# EAGLE schematic board (EAGLE 9.5.2)
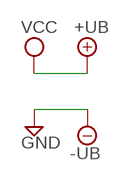
[diagram p0: schematic, sheet 1, part 1 of 3]
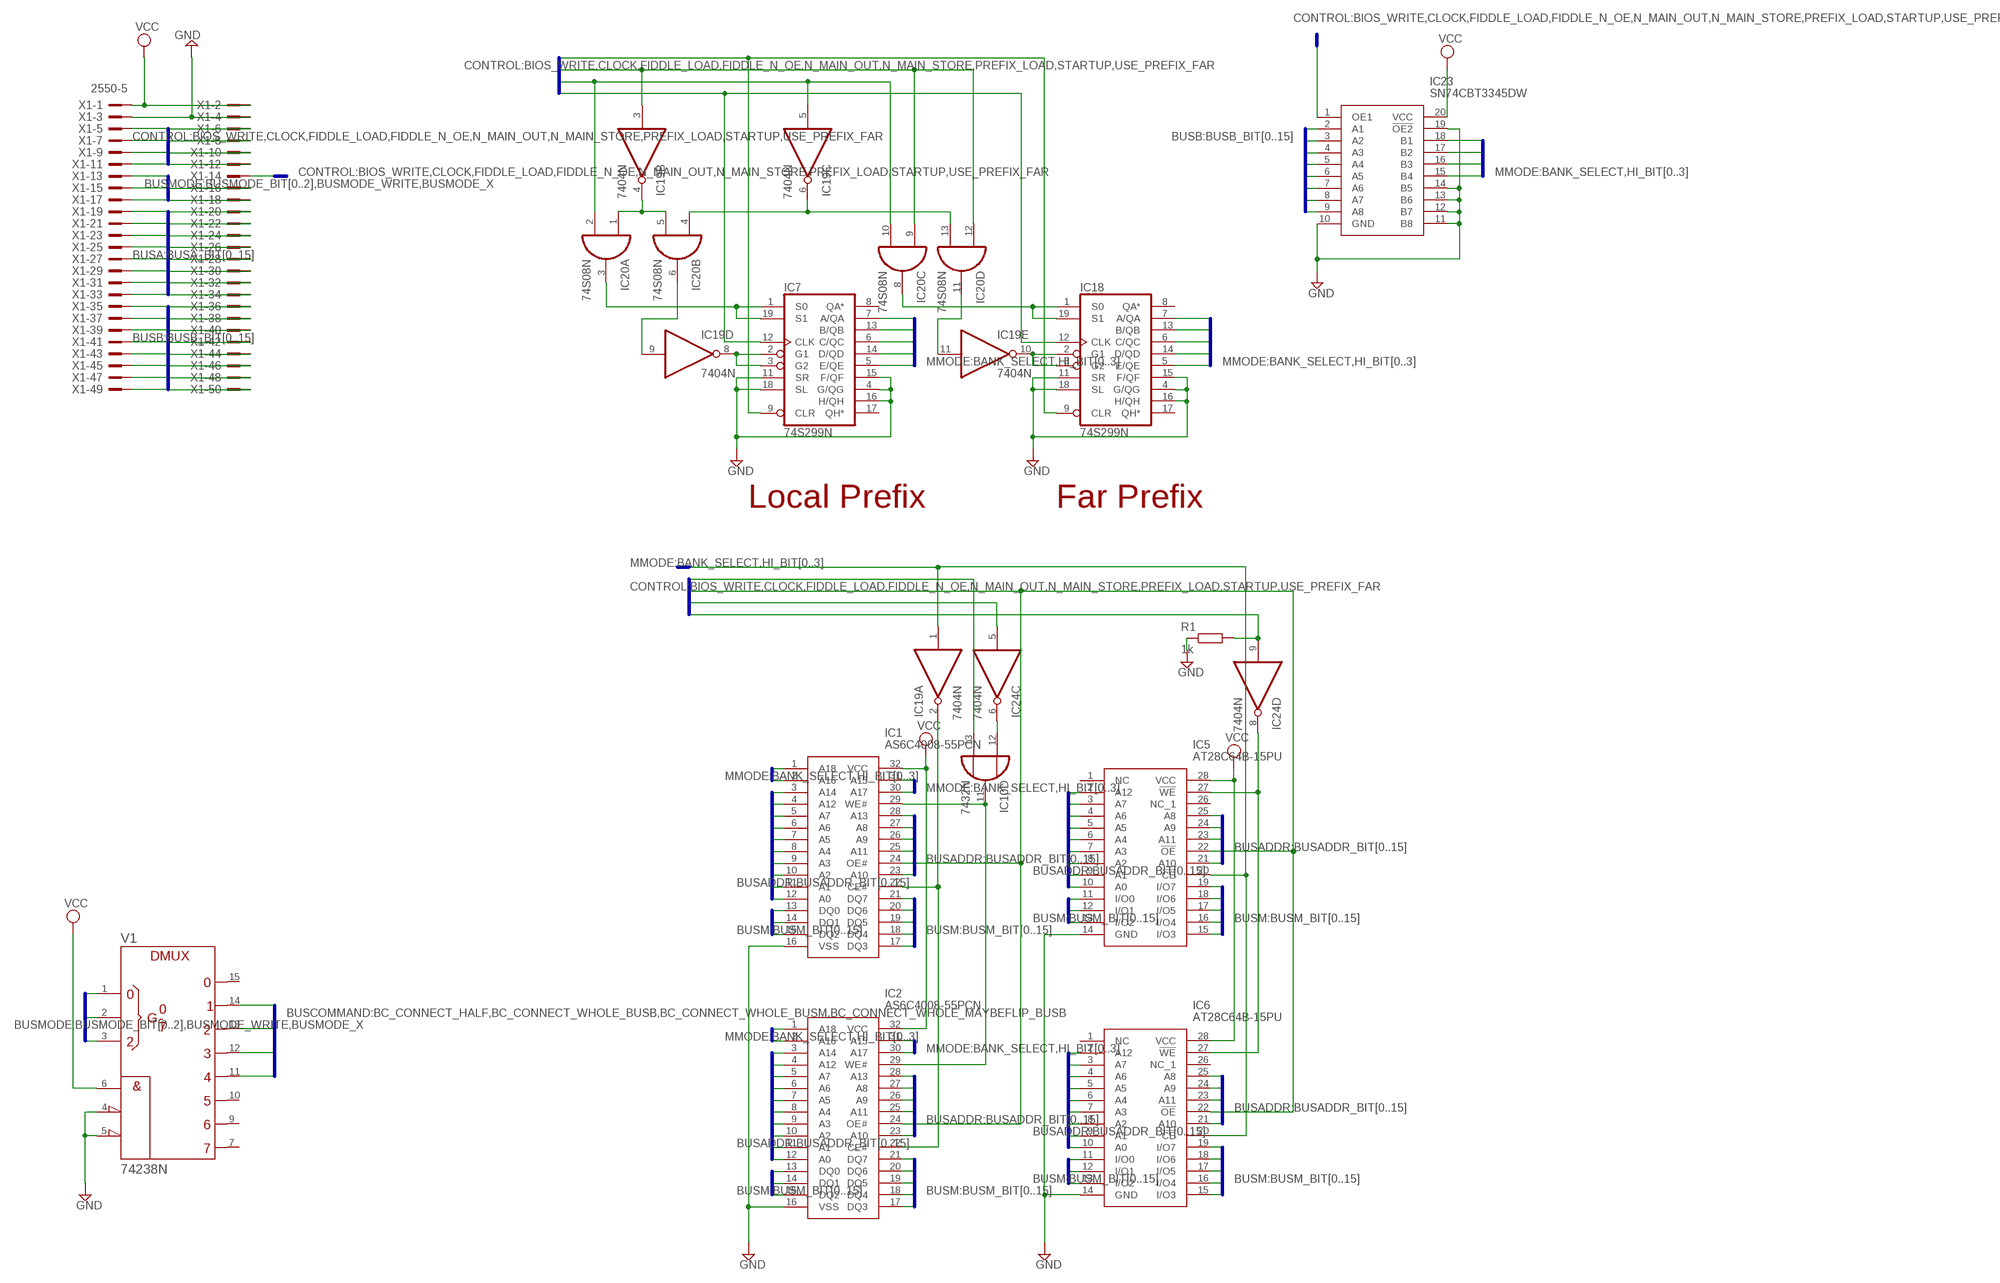
[diagram p1: schematic, sheet 1, part 2 of 3]
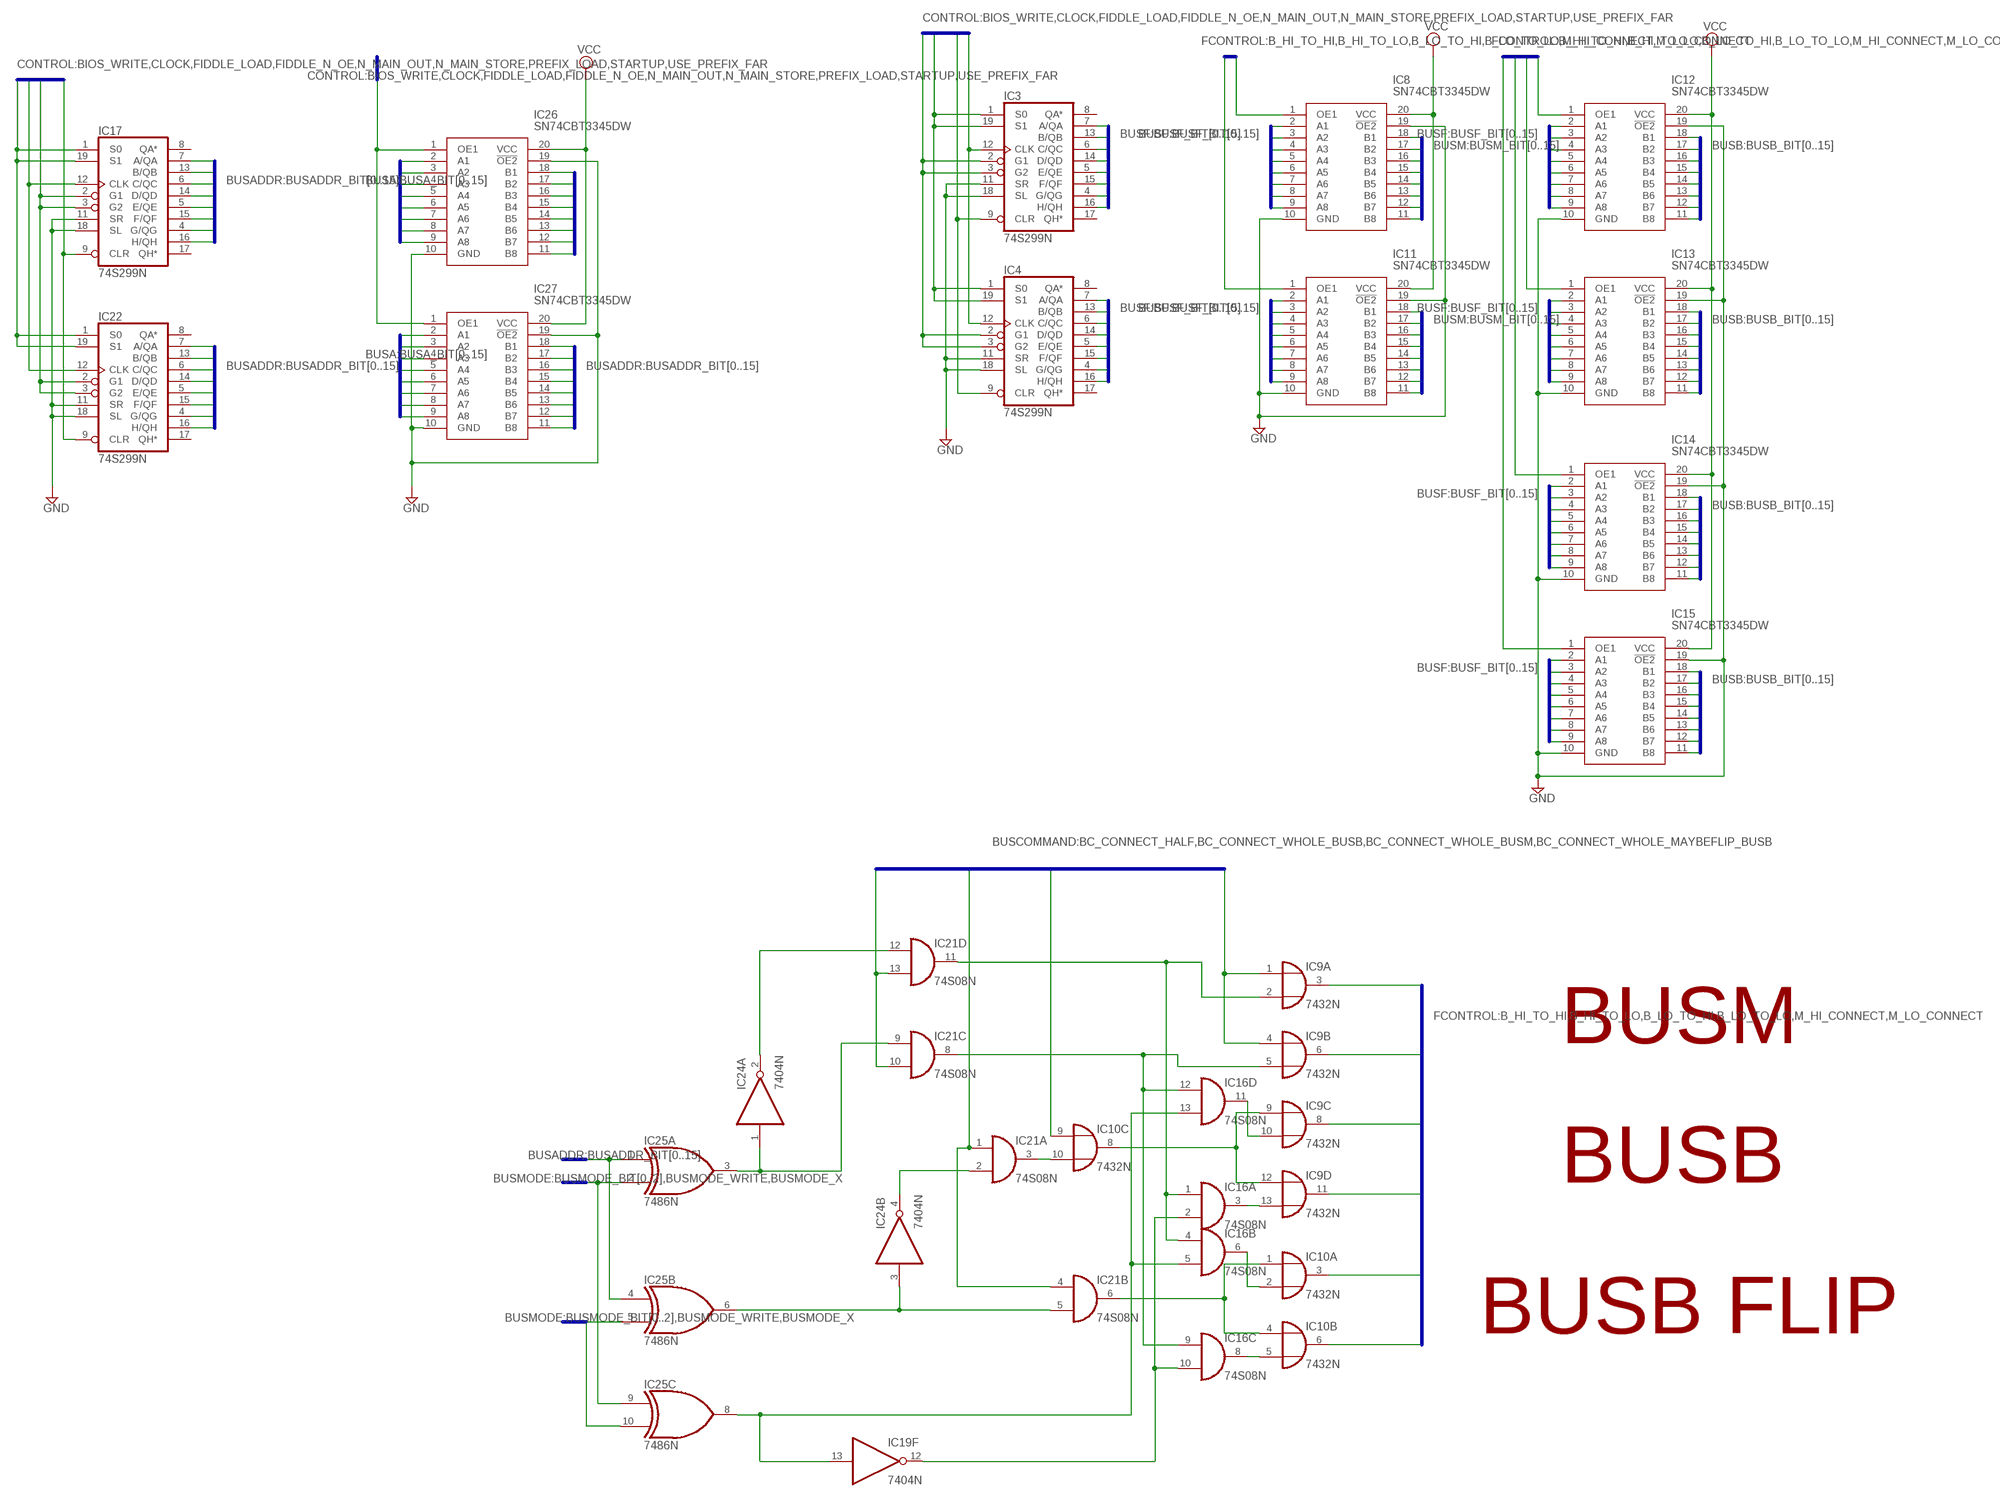
[diagram p2: schematic, sheet 1, part 3 of 3]

## Parts
IC1  AS6C4008-55PCN  [DIP1524W58P254L4191H406Q32N]
IC2  AS6C4008-55PCN  [DIP1524W58P254L4191H406Q32N]
IC3  74S299N  [DIL20]
IC4  74S299N  [DIL20]
IC5  AT28C64B-15PU  [DIP1556W56P254L3702H483Q28N]
IC6  AT28C64B-15PU  [DIP1556W56P254L3702H483Q28N]
IC7  74S299N  [DIL20]
IC8  SN74CBT3345DW  [SOIC127P1030X265-20N]
IC9  7432N  [DIL14]
IC10  7432N  [DIL14]
IC11  SN74CBT3345DW  [SOIC127P1030X265-20N]
IC12  SN74CBT3345DW  [SOIC127P1030X265-20N]
IC13  SN74CBT3345DW  [SOIC127P1030X265-20N]
IC14  SN74CBT3345DW  [SOIC127P1030X265-20N]
IC15  SN74CBT3345DW  [SOIC127P1030X265-20N]
IC16  74S08N  [DIL14]
IC17  74S299N  [DIL20]
IC18  74S299N  [DIL20]
IC19  7404N  [DIL14]
IC20  74S08N  [DIL14]
IC21  74S08N  [DIL14]
IC22  74S299N  [DIL20]
IC23  SN74CBT3345DW  [SOIC127P1030X265-20N]
IC24  7404N  [DIL14]
IC25  7486N  [DIL14]
IC26  SN74CBT3345DW  [SOIC127P1030X265-20N]
IC27  SN74CBT3345DW  [SOIC127P1030X265-20N]
R1  1k  R-EU_0207/10  [0207/10]
V1  74238N  [DIL16]
X1  2550-5  [PAK100/2500-5-50]

## Nets
B_HI_TO_HI: IC9.11(D:O) IC15.1(OE1)
B_HI_TO_LO: IC10.6(B:O) IC14.1(OE1)
B_LO_TO_HI: IC10.3(A:O) IC13.1(OE1)
B_LO_TO_LO: IC9.8(C:O) IC12.1(OE1)
BANK_SELECT: IC5.20(!CE) IC6.20(!CE) IC7.7(A/QA) IC18.7(A/QA) IC19.1(A:I)
BC_CONNECT_HALF: IC21.10(C:I1) IC21.13(D:I1) V1.14(Y1)
BC_CONNECT_WHOLE_BUSB: IC10.9(C:I0) V1.12(Y3)
BC_CONNECT_WHOLE_BUSM: IC9.1(A:I0) IC9.4(B:I0) V1.13(Y2)
BC_CONNECT_WHOLE_MAYBEFLIP_BUSB: IC21.1(A:I0) IC21.4(B:I0) V1.11(Y4)
BIOS_WRITE: IC24.9(D:I) R1.2 X1.14
BUSA_BIT0: IC26.2(A1) X1.19
BUSA_BIT1: IC26.3(A2) X1.20
BUSA_BIT2: IC26.4(A3) X1.21
BUSA_BIT3: IC26.5(A4) X1.22
BUSA_BIT4: IC26.6(A5) X1.23
BUSA_BIT5: IC26.7(A6) X1.24
BUSA_BIT6: IC26.8(A7) X1.25
BUSA_BIT7: IC26.9(A8) X1.26
BUSA_BIT8: IC27.2(A1) X1.27
BUSA_BIT9: IC27.3(A2) X1.28
BUSA_BIT10: IC27.4(A3) X1.29
BUSA_BIT11: IC27.5(A4) X1.30
BUSA_BIT12: IC27.6(A5) X1.31
BUSA_BIT13: IC27.7(A6) X1.32
BUSA_BIT14: IC27.8(A7) X1.33
BUSA_BIT15: IC27.9(A8) X1.34
BUSADDR_BIT0: IC17.7(A/QA) IC25.1(A:I0) IC25.4(B:I0) IC26.18(B1)
BUSADDR_BIT1: IC1.12(A0) IC2.12(A0) IC5.10(A0) IC6.10(A0) IC17.13(B/QB) IC26.17(B2)
BUSADDR_BIT2: IC1.11(A1) IC2.11(A1) IC5.9(A1) IC6.9(A1) IC17.6(C/QC) IC26.16(B3)
BUSADDR_BIT3: IC1.10(A2) IC2.10(A2) IC5.8(A2) IC6.8(A2) IC17.14(D/QD) IC26.15(B4)
BUSADDR_BIT4: IC1.9(A3) IC2.9(A3) IC5.7(A3) IC6.7(A3) IC17.5(E/QE) IC26.14(B5)
BUSADDR_BIT5: IC1.8(A4) IC2.8(A4) IC5.6(A4) IC6.6(A4) IC17.15(F/QF) IC26.13(B6)
BUSADDR_BIT6: IC1.7(A5) IC2.7(A5) IC5.5(A5) IC6.5(A5) IC17.4(G/QG) IC26.12(B7)
BUSADDR_BIT7: IC1.6(A6) IC2.6(A6) IC5.4(A6) IC6.4(A6) IC17.16(H/QH) IC26.11(B8)
BUSADDR_BIT8: IC1.5(A7) IC2.5(A7) IC5.3(A7) IC6.3(A7) IC22.7(A/QA) IC27.18(B1)
BUSADDR_BIT9: IC1.27(A8) IC2.27(A8) IC5.25(A8) IC6.25(A8) IC22.13(B/QB) IC27.17(B2)
BUSADDR_BIT10: IC1.26(A9) IC2.26(A9) IC5.24(A9) IC6.24(A9) IC22.6(C/QC) IC27.16(B3)
BUSADDR_BIT11: IC1.23(A10) IC2.23(A10) IC5.21(A10) IC6.21(A10) IC22.14(D/QD) IC27.15(B4)
BUSADDR_BIT12: IC1.25(A11) IC2.25(A11) IC5.23(A11) IC6.23(A11) IC22.5(E/QE) IC27.14(B5)
BUSADDR_BIT13: IC1.4(A12) IC2.4(A12) IC5.2(A12) IC6.2(A12) IC22.15(F/QF) IC27.13(B6)
BUSADDR_BIT14: IC1.28(A13) IC2.28(A13) IC22.4(G/QG) IC27.12(B7)
BUSADDR_BIT15: IC1.3(A14) IC2.3(A14) IC22.16(H/QH) IC27.11(B8)
BUSB_BIT0: IC12.18(B1) IC13.18(B1) IC23.2(A1) X1.35
BUSB_BIT1: IC12.17(B2) IC13.17(B2) IC23.3(A2) X1.36
BUSB_BIT2: IC12.16(B3) IC13.16(B3) IC23.4(A3) X1.37
BUSB_BIT3: IC12.15(B4) IC13.15(B4) IC23.5(A4) X1.38
BUSB_BIT4: IC12.14(B5) IC13.14(B5) IC23.6(A5) X1.39
BUSB_BIT5: IC12.13(B6) IC13.13(B6) IC23.7(A6) X1.40
BUSB_BIT6: IC12.12(B7) IC13.12(B7) IC23.8(A7) X1.41
BUSB_BIT7: IC12.11(B8) IC13.11(B8) IC23.9(A8) X1.42
BUSB_BIT8: IC14.18(B1) IC15.18(B1) X1.43
BUSB_BIT9: IC14.17(B2) IC15.17(B2) X1.44
BUSB_BIT10: IC14.16(B3) IC15.16(B3) X1.45
BUSB_BIT11: IC14.15(B4) IC15.15(B4) X1.46
BUSB_BIT12: IC14.14(B5) IC15.14(B5) X1.47
BUSB_BIT13: IC14.13(B6) IC15.13(B6) X1.48
BUSB_BIT14: IC14.12(B7) IC15.12(B7) X1.49
BUSB_BIT15: IC14.11(B8) IC15.11(B8) X1.50
BUSF_BIT0: IC3.7(A/QA) IC8.2(A1) IC12.2(A1) IC14.2(A1)
BUSF_BIT1: IC3.13(B/QB) IC8.3(A2) IC12.3(A2) IC14.3(A2)
BUSF_BIT2: IC3.6(C/QC) IC8.4(A3) IC12.4(A3) IC14.4(A3)
BUSF_BIT3: IC3.14(D/QD) IC8.5(A4) IC12.5(A4) IC14.5(A4)
BUSF_BIT4: IC3.5(E/QE) IC8.6(A5) IC12.6(A5) IC14.6(A5)
BUSF_BIT5: IC3.15(F/QF) IC8.7(A6) IC12.7(A6) IC14.7(A6)
BUSF_BIT6: IC3.4(G/QG) IC8.8(A7) IC12.8(A7) IC14.8(A7)
BUSF_BIT7: IC3.16(H/QH) IC8.9(A8) IC12.9(A8) IC14.9(A8)
BUSF_BIT8: IC4.7(A/QA) IC11.2(A1) IC13.2(A1) IC15.2(A1)
BUSF_BIT9: IC4.13(B/QB) IC11.3(A2) IC13.3(A2) IC15.3(A2)
BUSF_BIT10: IC4.6(C/QC) IC11.4(A3) IC13.4(A3) IC15.4(A3)
BUSF_BIT11: IC4.14(D/QD) IC11.5(A4) IC13.5(A4) IC15.5(A4)
BUSF_BIT12: IC4.5(E/QE) IC11.6(A5) IC13.6(A5) IC15.6(A5)
BUSF_BIT13: IC4.15(F/QF) IC11.7(A6) IC13.7(A6) IC15.7(A6)
BUSF_BIT14: IC4.4(G/QG) IC11.8(A7) IC13.8(A7) IC15.8(A7)
BUSF_BIT15: IC4.16(H/QH) IC11.9(A8) IC13.9(A8) IC15.9(A8)
BUSM_BIT0: IC1.13(DQ0) IC5.11(I/O0) IC6.11(I/O0) IC8.18(B1)
BUSM_BIT1: IC1.14(DQ1) IC5.12(I/O1) IC6.12(I/O1) IC8.17(B2)
BUSM_BIT2: IC1.15(DQ2) IC5.13(I/O2) IC6.13(I/O2) IC8.16(B3)
BUSM_BIT3: IC1.17(DQ3) IC5.15(I/O3) IC6.15(I/O3) IC8.15(B4)
BUSM_BIT4: IC1.18(DQ4) IC5.16(I/O4) IC6.16(I/O4) IC8.14(B5)
BUSM_BIT5: IC1.19(DQ5) IC5.17(I/O5) IC6.17(I/O5) IC8.13(B6)
BUSM_BIT6: IC1.20(DQ6) IC5.18(I/O6) IC6.18(I/O6) IC8.12(B7)
BUSM_BIT7: IC1.21(DQ7) IC5.19(I/O7) IC6.19(I/O7) IC8.11(B8)
BUSM_BIT8: IC2.13(DQ0) IC11.18(B1)
BUSM_BIT9: IC2.14(DQ1) IC11.17(B2)
BUSM_BIT10: IC2.15(DQ2) IC11.16(B3)
BUSM_BIT11: IC2.17(DQ3) IC11.15(B4)
BUSM_BIT12: IC2.18(DQ4) IC11.14(B5)
BUSM_BIT13: IC2.19(DQ5) IC11.13(B6)
BUSM_BIT14: IC2.20(DQ6) IC11.12(B7)
BUSM_BIT15: IC2.21(DQ7) IC11.11(B8)
BUSMODE_BIT0: V1.1(A) X1.13
BUSMODE_BIT1: V1.2(B) X1.15
BUSMODE_BIT2: V1.3(C) X1.17
BUSMODE_WRITE: IC25.2(A:I1) IC25.9(C:I0) X1.16
BUSMODE_X: IC25.5(B:I1) IC25.10(C:I1) X1.18
CLOCK: IC3.12(CLK) IC4.12(CLK) IC7.12(CLK) IC17.12(CLK) IC18.12(CLK) IC22.12(CLK) IC24.5(C:I) X1.5
FIDDLE_LOAD: IC3.1(S0) IC3.19(S1) IC4.1(S0) IC4.19(S1) IC17.1(S0) IC17.19(S1) IC22.1(S0) IC22.19(S1) IC26.1(OE1) IC27.1(OE1) X1.11
FIDDLE_N_OE: IC3.2(G1) IC3.3(G2) IC4.2(G1) IC4.3(G2) IC17.2(G1) IC17.3(G2) IC22.2(G1) IC22.3(G2) X1.12
GND: IC1.16(VSS) IC2.16(VSS) IC3.11(SR) IC3.18(SL) IC4.11(SR) IC4.18(SL) IC5.14(GND) IC6.14(GND) IC7.4(G/QG) IC7.11(SR) IC7.15(F/QF) IC7.16(H/QH) IC7.18(SL) IC8.10(GND) IC8.19(!OE2) IC11.10(GND) IC11.19(!OE2) IC12.10(GND) IC12.19(!OE2) IC13.10(GND) IC13.19(!OE2) IC14.10(GND) IC14.19(!OE2) IC15.10(GND) IC15.19(!OE2) IC17.11(SR) IC17.18(SL) IC18.4(G/QG) IC18.11(SR) IC18.15(F/QF) IC18.16(H/QH) IC18.18(SL) IC22.11(SR) IC22.18(SL) IC23.10(GND) IC23.11(B8) IC23.12(B7) IC23.13(B6) IC23.14(B5) IC23.19(!OE2) IC26.10(GND) IC26.19(!OE2) IC27.10(GND) IC27.19(!OE2) R1.1 V1.4(!G2A) V1.5(!G2B) X1.3 X1.4 ; supply symbol labelled -UB
HI_BIT0: IC1.31(A15) IC2.31(A15) IC7.13(B/QB) IC18.13(B/QB) IC23.18(B1)
HI_BIT1: IC1.2(A16) IC2.2(A16) IC7.6(C/QC) IC18.6(C/QC) IC23.17(B2)
HI_BIT2: IC1.30(A17) IC2.30(A17) IC7.14(D/QD) IC18.14(D/QD) IC23.16(B3)
HI_BIT3: IC1.1(A18) IC2.1(A18) IC7.5(E/QE) IC18.5(E/QE) IC23.15(B4)
M_HI_CONNECT: IC9.6(B:O) IC11.1(OE1)
M_LO_CONNECT: IC8.1(OE1) IC9.3(A:O)
N$1: IC19.4(B:O) IC20.1(A:I0) IC20.5(B:I1)
N$2: IC7.1(S0) IC7.19(S1) IC20.3(A:O)
N$3: IC18.1(S0) IC18.19(S1) IC20.8(C:O)
N$4: IC18.2(G1) IC18.3(G2) IC19.10(E:O)
N$5: IC7.2(G1) IC7.3(G2) IC19.8(D:O)
N$6: IC1.22(CE#) IC2.22(CE#) IC19.2(A:O)
N$7: IC19.11(E:I) IC20.11(D:O)
N$8: IC19.9(D:I) IC20.6(B:O)
N$9: IC19.6(C:O) IC20.4(B:I0) IC20.13(D:I1)
N$10: IC10.1(A:I0) IC10.4(B:I0) IC21.6(B:O)
N$11: IC10.10(C:I1) IC21.3(A:O)
N$12: IC21.2(A:I1) IC24.4(B:O)
N$13: IC9.10(C:I1) IC16.11(D:O)
N$14: IC21.5(B:I1) IC24.3(B:I) IC25.6(B:O)
N$15: IC9.5(B:I1) IC16.9(C:I0) IC16.12(D:I0) IC21.8(C:O)
N$16: IC21.12(D:I0) IC24.2(A:O)
N$17: IC21.9(C:I0) IC24.1(A:I) IC25.3(A:O)
N$18: IC9.9(C:I0) IC9.12(D:I0) IC10.8(C:O)
N$19: IC9.13(D:I1) IC16.3(A:O)
N$20: IC10.2(A:I1) IC16.6(B:O)
N$21: IC10.5(B:I1) IC16.8(C:O)
N$22: IC9.2(A:I1) IC16.1(A:I0) IC16.4(B:I0) IC21.11(D:O)
N$23: IC16.2(A:I1) IC16.10(C:I1) IC19.12(F:O)
N$24: IC16.5(B:I1) IC16.13(D:I1) IC19.13(F:I) IC25.8(C:O)
N$25: IC1.29(WE#) IC2.29(WE#) IC10.11(D:O)
N$26: IC10.12(D:I0) IC24.6(C:O)
N$27: IC5.27(!WE) IC6.27(!WE) IC24.8(D:O)
N_MAIN_OUT: IC1.24(OE#) IC2.24(OE#) IC5.22(!OE) IC6.22(!OE) X1.9
N_MAIN_STORE: IC10.13(D:I1) X1.10
PREFIX_LOAD: IC19.5(C:I) IC20.2(A:I1) IC20.10(C:I1) IC23.1(OE1) X1.8
STARTUP: IC3.9(CLR) IC4.9(CLR) IC7.9(CLR) IC17.9(CLR) IC18.9(CLR) IC22.9(CLR) X1.6
USE_PREFIX_FAR: IC19.3(B:I) IC20.9(C:I0) IC20.12(D:I0) X1.7
VCC: IC1.32(VCC) IC2.32(VCC) IC5.28(VCC) IC6.28(VCC) IC8.20(VCC) IC11.20(VCC) IC12.20(VCC) IC13.20(VCC) IC14.20(VCC) IC15.20(VCC) IC23.20(VCC) IC26.20(VCC) IC27.20(VCC) V1.6(G1) X1.1 X1.2 ; supply symbol labelled +UB
Unconnected: IC3.8(QA*) IC3.17(QH*) IC4.8(QA*) IC4.17(QH*) IC5.1(NC) IC5.26(NC_1) IC6.1(NC) IC6.26(NC_1) IC7.8(QA*) IC7.17(QH*) IC17.8(QA*) IC17.17(QH*) IC18.8(QA*) IC18.17(QH*) IC22.8(QA*) IC22.17(QH*) IC24.10(E:O) IC24.11(E:I) IC24.12(F:O) IC24.13(F:I) IC25.11(D:O) IC25.12(D:I0) IC25.13(D:I1) V1.7(Y7) V1.9(Y6) V1.10(Y5) V1.15(Y0)

## Buses
BUSM:BUSM_BIT[0..15]
MMODE:BANK_SELECT,HI_BIT[0..3]
BUSF:BUSF_BIT[0..15]
BUSB:BUSB_BIT[0..15]
BUSADDR:BUSADDR_BIT[0..15]
CONTROL:BIOS_WRITE,CLOCK,FIDDLE_LOAD,FIDDLE_N_OE,N_MAIN_OUT,N_MAIN_STORE,PREFIX_LOAD,STARTUP,USE_PREFIX_FAR
FCONTROL:B_HI_TO_HI,B_HI_TO_LO,B_LO_TO_HI,B_LO_TO_LO,M_HI_CONNECT,M_LO_CONNECT
BUSMODE:BUSMODE_BIT[0..2],BUSMODE_WRITE,BUSMODE_X
BUSCOMMAND:BC_CONNECT_HALF,BC_CONNECT_WHOLE_BUSB,BC_CONNECT_WHOLE_BUSM,BC_CONNECT_WHOLE_MAYBEFLIP_BUSB
BUSA:BUSA_BIT[0..15]

## Notes on the sheet
- Local Prefix | Far Prefix
- BUSM
- BUSB
- BUSB FLIP

## Power pins joined to a net without a drawn wire
GND: IC3.10(GND) IC4.10(GND) IC7.10(GND) IC9.7(P:GND) IC10.7(P:GND) IC16.7(P:GND) IC17.10(GND) IC18.10(GND) IC19.7(P:GND) IC20.7(P:GND) IC21.7(P:GND) IC22.10(GND) IC24.7(P:GND) IC25.7(P:GND) V1.8(-UB)
VCC: IC3.20(VCC) IC4.20(VCC) IC7.20(VCC) IC9.14(P:VCC) IC10.14(P:VCC) IC16.14(P:VCC) IC17.20(VCC) IC18.20(VCC) IC19.14(P:VCC) IC20.14(P:VCC) IC21.14(P:VCC) IC22.20(VCC) IC24.14(P:VCC) IC25.14(P:VCC) V1.16(+UB)

## Library data of the parts
IC1 IC2 = SamacSys_Parts:AS6C4008-55PCN: CMOS SRAM Source: Datasheet <http://uk.rs-online.com/web/p/products/7444561P>; DESCRIPTION: CMOS SRAM; HEIGHT: 4.064mm; MANUFACTURER_NAME: Alliance Memory; MANUFACTURER_PART_NUMBER: AS6C4008-55PCN; RS_PART_NUMBER: 7444561P; RS_PRICE-STOCK: http://uk.rs-online.com/web/p/products/7444561P
IC3 IC4 IC7 IC17 IC18 IC22 = 74xx-eu:74*299: 8-bit universal SHIFT/STORAGE REGISTER
IC5 IC6 = SamacSys_Parts:AT28C64B-15PU: AT28C64B-15PU, Parallel EEPROM Memory 64kbit, Parallel, 150ns 4.5 5.5 V, 28-Pin PDIP Source: Datasheet <https://componentsearchengine.com/Datasheets/1/AT28C64B-15PU.pdf>; DESCRIPTION: AT28C64B-15PU, Parallel EEPROM Memory 64kbit, Parallel, 150ns 4.5 5.5 V, 28-Pin PDIP; HEIGHT: 4.826mm; MANUFACTURER_NAME: Microchip; MANUFACTURER_PART_NUMBER: AT28C64B-15PU; MOUSER_PART_NUMBER: 556-AT28C64B15PU; MOUSER_PRICE-STOCK: https://www.mouser.com/Search/Refine.aspx?Keyword=556-AT28C64B15PU
IC8 IC11-IC15 IC23 IC26 IC27 = SamacSys_Parts:SN74CBT3345DW: Texas Instruments SN74CBT3345DW, Bus Switch, 8 x 1:1, 4.5 5.5 V, 20-Pin SOIC Source: Datasheet <https://www.ti.com/lit/ds/symlink/sn74cbt3345.pdf>; DESCRIPTION: Texas Instruments SN74CBT3345DW, Bus Switch, 8 x 1:1, 4.5 5.5 V, 20-Pin SOIC; HEIGHT: 2.65mm; MANUFACTURER_NAME: Texas Instruments; MANUFACTURER_PART_NUMBER: SN74CBT3345DW
IC9 IC10 = 74xx-eu:74*32: Quad 2-input OR gate
IC16 IC20 IC21 = 74xx-eu:74*08: Quad 2-input AND gate
IC19 IC24 = 74xx-eu:74*04: Hex INVERTER
IC25 = 74xx-us:74*86: Quad 2-input EXCLUSIV-OR (XOR) gate
R1 = rcl:R-EU_: RESISTOR, European symbol; SPICEPREFIX: R
V1 = 74ttl-din:74*238: 1 of 8 noninverting DECODER/DEMULTIPLEXER
X1 = con-3m:2550-: 3M (TM) Pak 100 4-Wall Header Source: 3M; OC_FARNELL: 1788696; OC_NEWARK: unknown